# Altium project STM32F103C8T6.PrjPcb
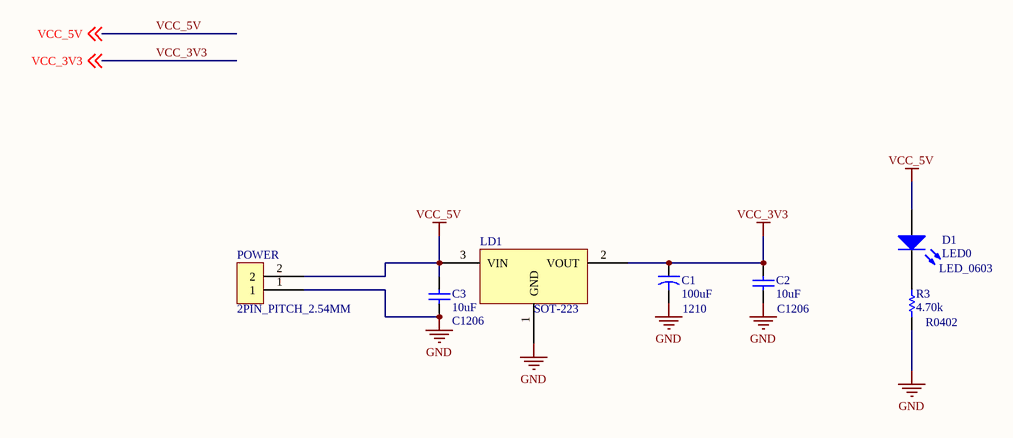
[diagram p0: 01 POWER.SchDoc]
4 sheets, 35 parts. Net scope: global (net labels, ports and power ports of the same name join across sheets).
Board file: STM32FC8T6.PcbDoc
Sheets:
  01 POWER.SchDoc
  02 CPU STM32F103C8T6.SchDoc
  03 BEEP.SchDoc
  04 MP_SIGNAL.SchDoc

## Sheet 01 POWER.SchDoc
size A4

### Parts
(Parts that share a designator on the sheet are numbered #1, #2 ... from top to bottom, then left to right.)
C1  100uF  [1210]
C2  10uF  [C1206]
C3  10uF  [C1206]
D1  LED0  [LED_0603]
LD1  SOT-223  [LD1117S33TR]
POWER  2PIN_PITCH_2.54MM  [2PIN_PITCH_2.54MM]
R3#1  4.70k  [R0402]

### Nets
GND: C1.2 C2.1 C3.1 LD1.1(GND) POWER.1 R3#1.2
VCC_3V3: C1.1 C2.2 LD1.2(VOUT) ; off-sheet VCC_3V3
VCC_5V: C3.2 D1.1(A) LD1.3(VIN) POWER.2 ; off-sheet VCC_5V
NetD1_2: D1.2(K) R3#1.1

### Library data of the parts
C1 = Cap2: Capacitor; Value: 100pF; Published: 23-Sep-2002; PackageReference: CAPR5-4X5; Publisher: Altium Limited; PackageDescription: Capacitor; 2 Leads
C2 = Cap: Capacitor; Value: 100pF; Published: 8-Jun-2000; LatestRevisionDate: 17-Jul-2002; LatestRevisionNote: Re-released for DXP Platform.; PackageReference: RAD-0.3; Publisher: Altium Limited; PackageDescription: Radial Cap, Thru-Hole; 2 Leads; 0.3 in Pin Spacing
C3 = Cap: Capacitor; Published: 8-Jun-2000; LatestRevisionDate: 17-Jul-2002; LatestRevisionNote: Re-released for DXP Platform.; PackageReference: C1206; Publisher: Altium Limited; PackageDescription: Radial Cap, Thru-Hole; 2 Leads; 0.3 in Pin Spacing
D1 = LED0: Typical INFRARED GaAs LED; Published: 8-Jun-2000; LatestRevisionDate: 08-Jul-2005; LatestRevisionNote: Mech Layer 1 removed.; PackageReference: LED-0; Publisher: Altium Limited; PackageDescription: LED; 2 Leads; footpriint: LED_0603
LD1 = LD1117S33TR
R3#1 = Res1: Resistor; Value: 1K; Published: 8-Jun-2000; LatestRevisionDate: 17-Jul-2002; LatestRevisionNote: Re-released for DXP Platform.; PackageReference: AXIAL-0.3; Publisher: Altium Limited; PackageDescription: Axial Device, Thru-Hole; 2 Leads; 0.3 in Pin Spacing

## Sheet 02 CPU STM32F103C8T6.SchDoc
size A4
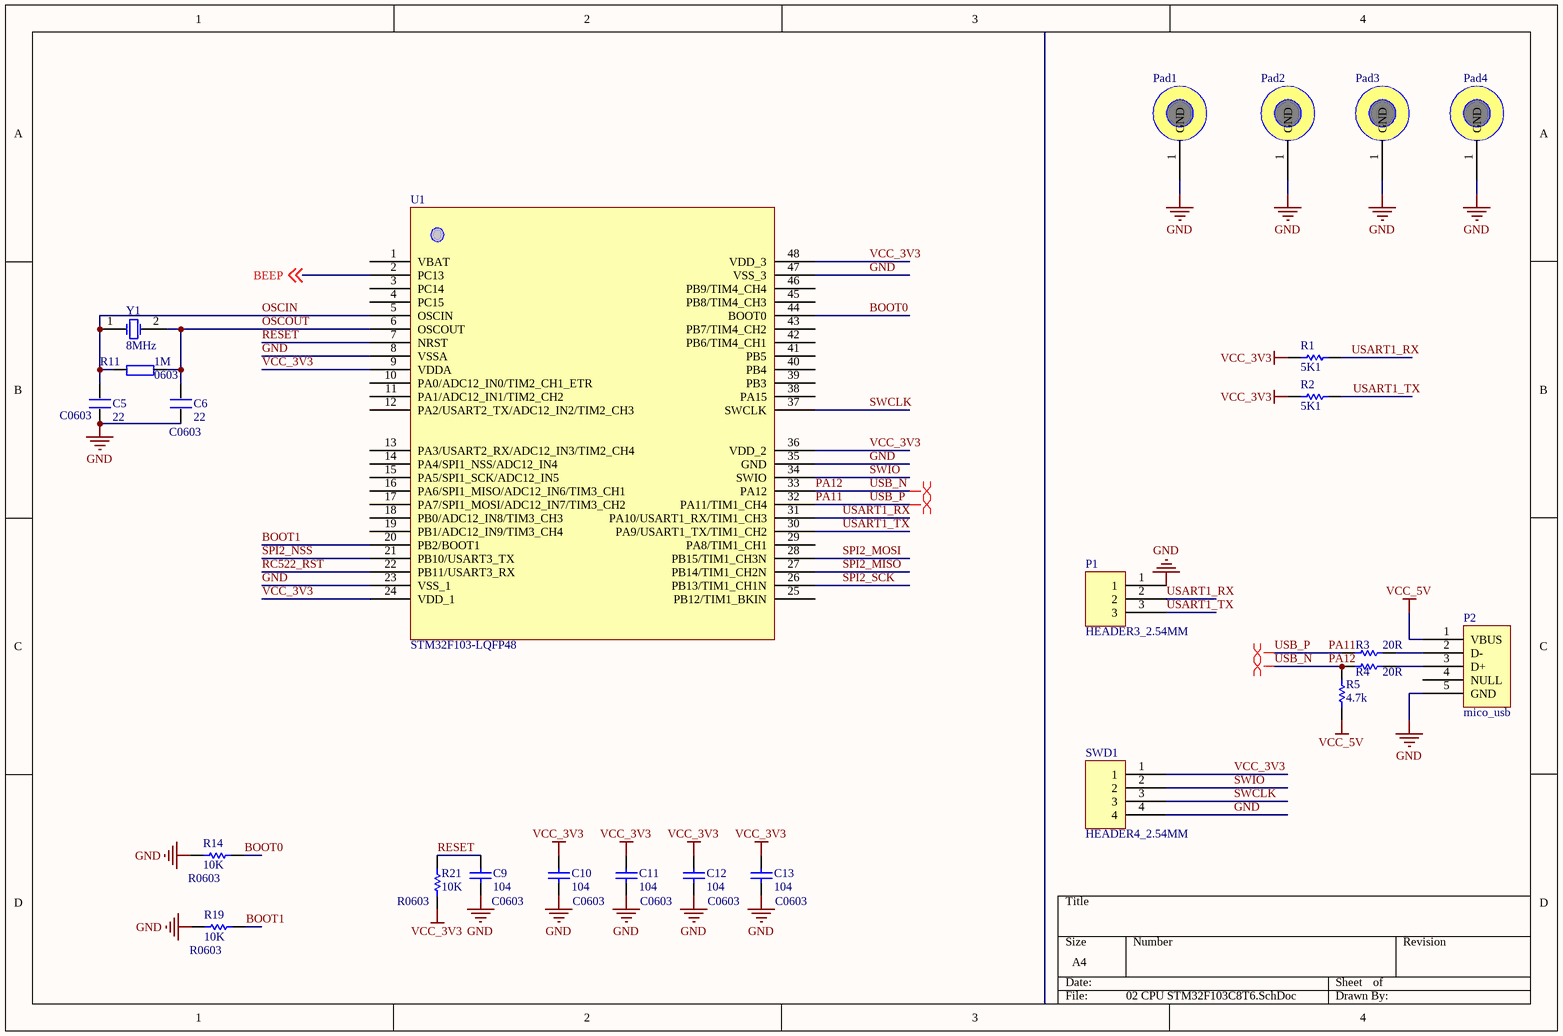
[diagram p1: 02 CPU STM32F103C8T6.SchDoc]

### Parts
(Parts that share a designator on the sheet are numbered #1, #2 ... from top to bottom, then left to right.)
C5  22  [C0603]
C6  22  [C0603]
C9  104  [C0603]
C10  104  [C0603]
C11  104  [C0603]
C12  104  [C0603]
C13  104  [C0603]
P1  HEADER3_2.54MM  [HEADER3_2.54MM]
P2  mico_usb  [mico_usb]
Pad1  PAD_3.3(6.8)  [PAD_3.3(6.8)]  (value not drawn)
Pad2  PAD_3.3(6.8)  [PAD_3.3(6.8)]  (value not drawn)
Pad3  PAD_3.3(6.8)  [PAD_3.3(6.8)]  (value not drawn)
Pad4  PAD_3.3(6.8)  [PAD_3.3(6.8)]  (value not drawn)
R1  5K1  [R0603]
R2  5K1  [R0603]
R3#2  20R  [R0603]
R4  20R  [R0603]
R5  4.7k  [R0603]
R11  1M  footprint: 0603  [R0603]
R14  10K  [R0603]
R19  10K  [R0603]
R21  10K  [R0603]
SWD1  HEADER4_2.54MM  [HEADER4_2.54MM]
U1  STM32F103-LQFP48  [STM32F103_48P]
Y1  8MHz  [XTAL8M]

### Nets
GND: C5.1 C6.1 C9.2 C10.2 C11.2 C12.2 C13.2 P1.1 P2.5(GND) Pad1.1(GND) Pad2.1(GND) Pad3.1(GND) Pad4.1(GND) R14.1 R19.1 SWD1.4 U1.8(VSSA) U1.23(VSS_1) U1.35(GND) U1.47(VSS_3)
VCC_3V3: C10.1 C11.1 C12.1 C13.1 R1.1 R2.1 R21.1 SWD1.1 U1.9(VDDA) U1.24(VDD_1) U1.36(VDD_2) U1.48(VDD_3)
VCC_5V: P2.1(VBUS) R5.1
BEEP: U1.2(PC13) ; off-sheet BEEP
BOOT0: R14.2 U1.44(BOOT0)
BOOT1: R19.2 U1.20(PB2/BOOT1)
OSCIN: C5.2 R11.1 U1.5(OSCIN) Y1.1(OSC1)
OSCOUT: C6.2 R11.2 U1.6(OSCOUT) Y1.2(OSC2)
PA11: R3#2.1 U1.32(PA11/TIM1_CH4)  [also labelled USB_P]
PA12: R4.1 R5.2 U1.33(PA12)  [also labelled USB_N]
RC522_RST: U1.22(PB11/USART3_RX)
RESET: C9.1 R21.2 U1.7(NRST)
SPI2_MISO: U1.27(PB14/TIM1_CH2N)
SPI2_MOSI: U1.28(PB15/TIM1_CH3N)
SPI2_NSS: U1.21(PB10/USART3_TX)
SPI2_SCK: U1.26(PB13/TIM1_CH1N)
SWCLK: SWD1.3 U1.37(SWCLK)
SWIO: SWD1.2 U1.34(SWIO)
USART1_RX: P1.2 R1.2 U1.31(PA10/USART1_RX/TIM1_CH3)
USART1_TX: P1.3 R2.2 U1.30(PA9/USART1_TX/TIM1_CH2)
NetP2_2: P2.2(D-) R3#2.2
NetP2_3: P2.3(D+) R4.2

Not connected (* = marked no-connect by the designer): P2 4(NULL); U1 1(VBAT) 3(PC14) 4(PC15) 10(PA0/ADC12_IN0/TIM2_CH1_ETR) 11(PA1/ADC12_IN1/TIM2_CH2) 12(PA2/USART2_TX/ADC12_IN2/TIM2_CH3) 13(PA3/USART2_RX/ADC12_IN3/TIM2_CH4) 14(PA4/SPI1_NSS/ADC12_IN4) 15(PA5/SPI1_SCK/ADC12_IN5) 16(PA6/SPI1_MISO/ADC12_IN6/TIM3_CH1) 17(PA7/SPI1_MOSI/ADC12_IN7/TIM3_CH2) 18(PB0/ADC12_IN8/TIM3_CH3) 19(PB1/ADC12_IN9/TIM3_CH4) 25(PB12/TIM1_BKIN) 29(PA8/TIM1_CH1) 38(PA15) 39(PB3) 40(PB4) 41(PB5) 42(PB6/TIM4_CH1) 43(PB7/TIM4_CH2) 45(PB8/TIM4_CH3) 46(PB9/TIM4_CH4)

### Layout directives
differential pair: PA11, PA12

### Library data of the parts
C5 C6 = C
C9 = Cap: Capacitor; Value: 100pF; Published: 8-Jun-2000; LatestRevisionDate: 17-Jul-2002; LatestRevisionNote: Re-released for DXP Platform.; PackageReference: RAD-0.3; Publisher: Altium Limited
C10-C13 = Cap: Capacitor; Manufacturer: Generic Components; Class: Passive; Value: 105; Published: 08/06/2000; Publisher: Altium Hobart Technology Centre; SubClass: Capacitor
R1 R2 R3#2 R4 R5 = Res1: Resistor; Manufacturer: Generic Components; Class: Passive; Value: 5.1K; Published: 08/06/2000; Publisher: Altium Hobart Technology Centre; SubClass: Resistor
R11 = R
R14 R19 R21 = Res Semi: Semiconductor Resistor; Value: 1K; Published: 8-Jun-2000; LatestRevisionDate: 17-Jul-2002; LatestRevisionNote: Re-released for DXP Platform.; PackageReference: AXIAL-0.5; Publisher: Altium Limited
Y1 = XTAL: Crystal Oscillator; Published: 8-Jun-2000; LatestRevisionDate: 17-Jul-2002; LatestRevisionNote: Re-released for DXP Platform.; Publisher: Altium Limited

## Sheet 03 BEEP.SchDoc
size A4
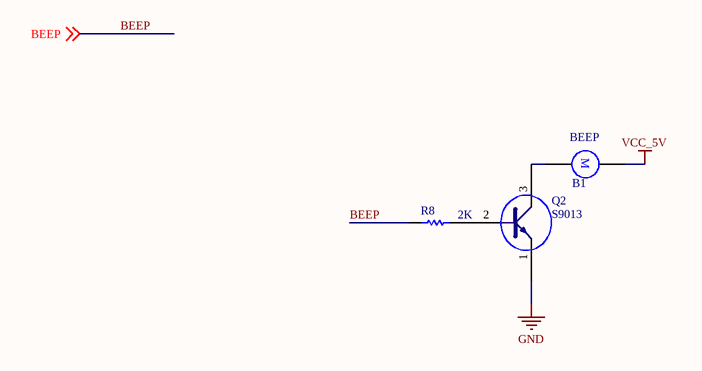
[diagram p2: 03 BEEP.SchDoc]

### Parts
B1  BEEP  [Beep]
Q2  S9013  [PNP-SOT-23]
R8  2K  [R0603]

### Nets
GND: Q2.1
VCC_5V: B1.1
BEEP: R8.1 ; off-sheet BEEP
NetB1_2: B1.2 Q2.3
NetQ2_2: Q2.2 R8.2

### Notes on the sheet
- (in symbol Motor) M

### Library data of the parts
B1 = Motor: Motor, General Kind; Manufacturer: Generic Components; Published: 1999
R8 = Res1: Resistor; Manufacturer: Generic Components; Class: Passive; Value: 100; Published: 08/06/2000; Publisher: Altium Hobart Technology Centre; SubClass: Resistor

## Sheet 04 MP_SIGNAL.SchDoc
size A4
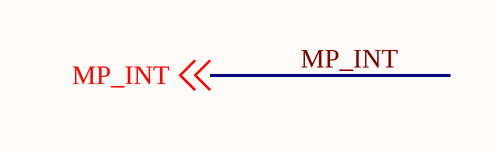
[diagram p3: 04 MP_SIGNAL.SchDoc]

## Nets that join several sheets
GND: 01 POWER (6 pins), 02 CPU STM32F103C8T6 (20 pins), 03 BEEP (Q2.1)
VCC_3V3: 01 POWER (C1.1 C2.2 LD1.2), 02 CPU STM32F103C8T6 (12 pins)
VCC_5V: 01 POWER (C3.2 D1.1 LD1.3 POWER.2), 02 CPU STM32F103C8T6 (P2.1 R5.1), 03 BEEP (B1.1)
BEEP: 02 CPU STM32F103C8T6 (U1.2), 03 BEEP (R8.1)